# EAGLE design 04A-020 (EAGLE 6.3)
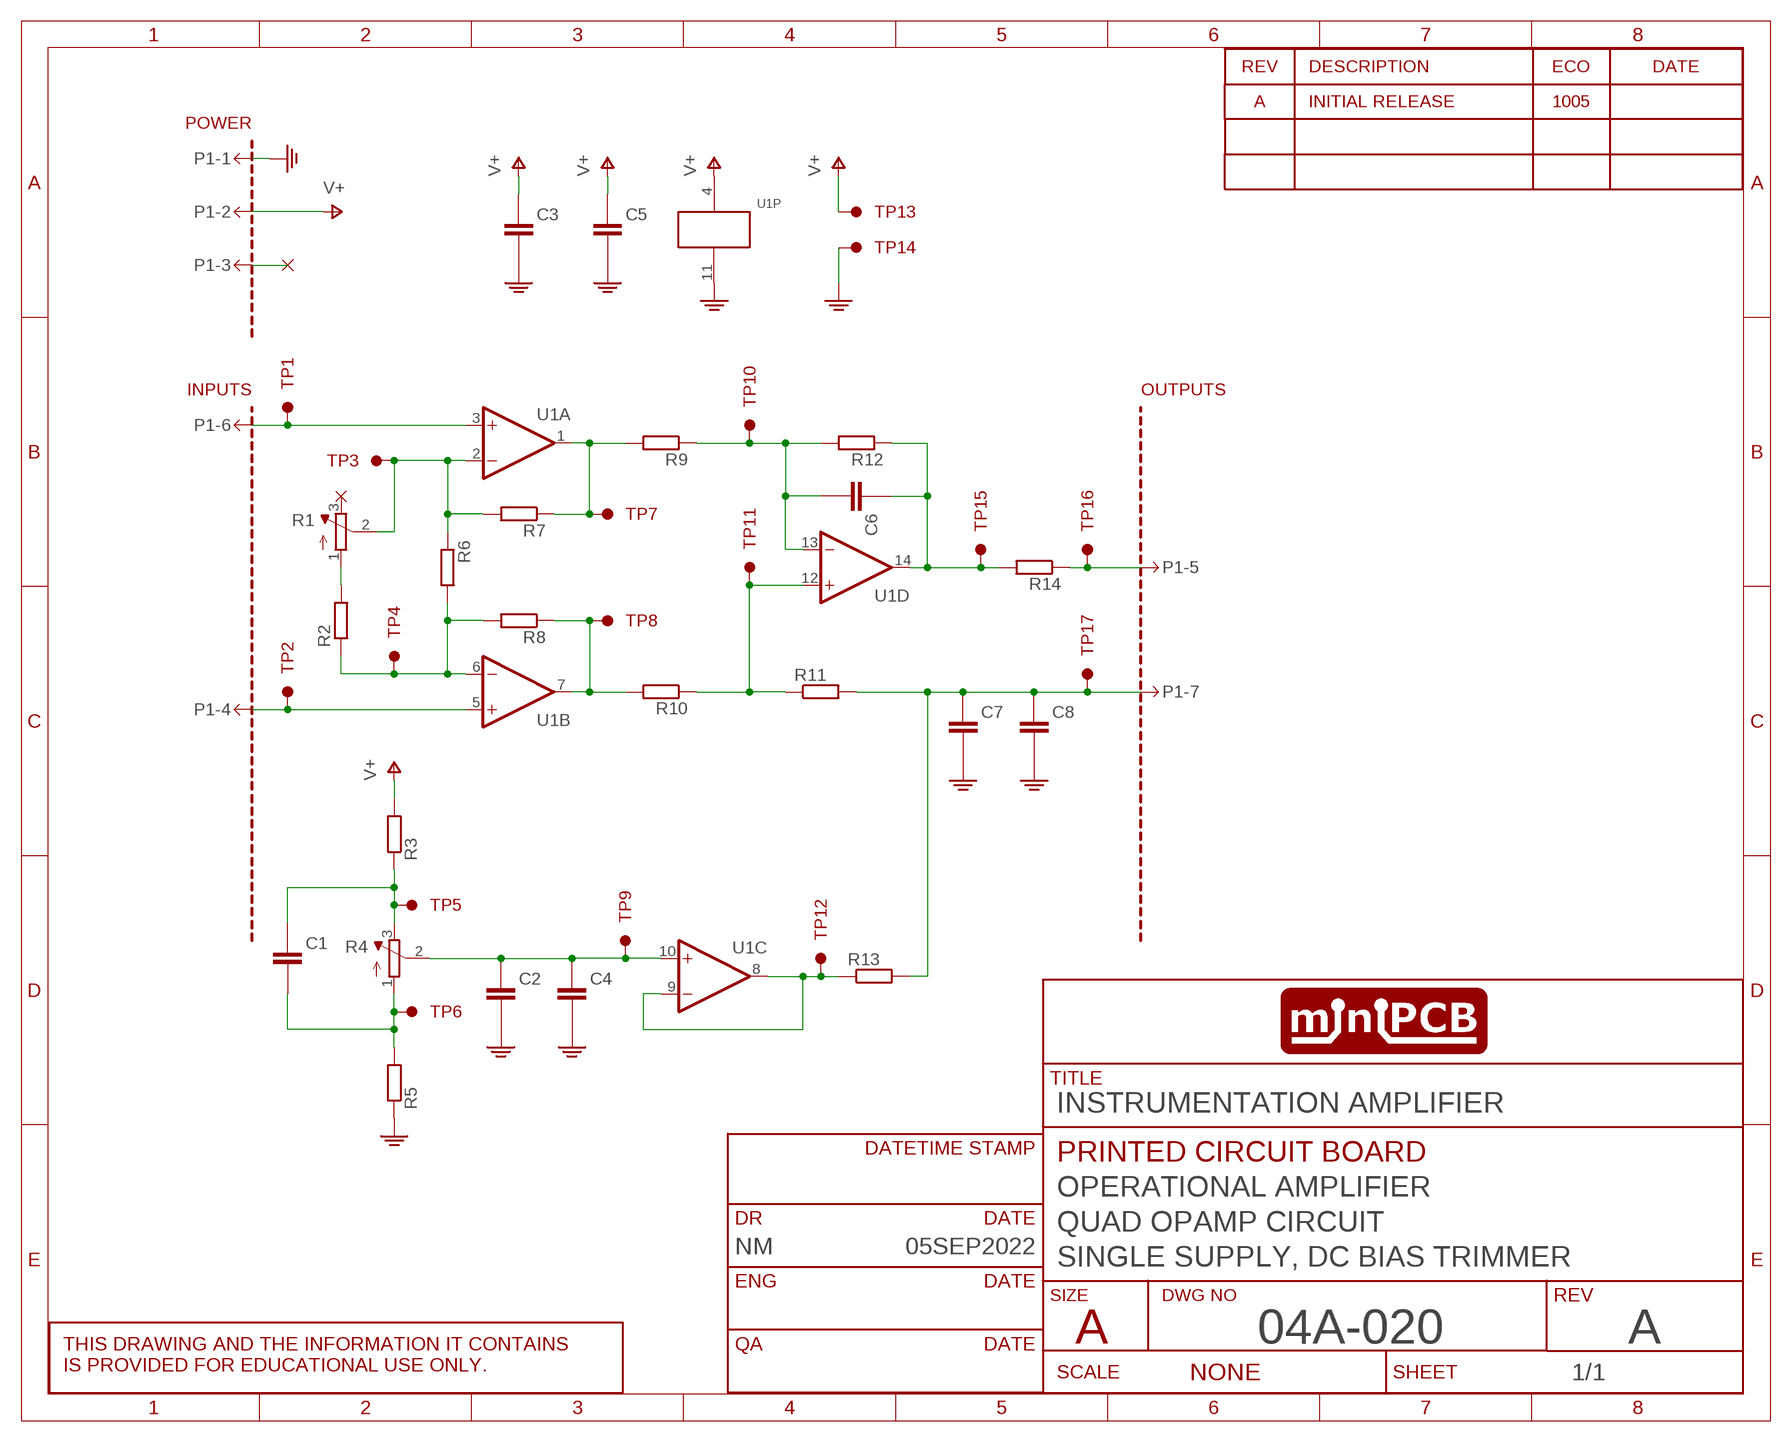
[diagram p0: schematic, sheet 1]
SHEET1 (SCHEMATIC): CIRCUIT_CATEGORY: OPERATIONAL AMPLIFIER; CIRCUIT_NAME: QUAD OPAMP CIRCUIT; CIRCUIT_VARIANT: SINGLE SUPPLY, DC BIAS TRIMMER; DR: NM; DR_DATE: 05SEP2022; REVA: A; REVA_ECO: 1005; REVISION: A; TITLE: INSTRUMENTATION AMPLIFIER

## Parts
C1  CAPACITORTHD  [C050-024X044]
C2  CAPACITORTHD  [C050-024X044]
C3  CAPACITORTHD  [C050-024X044]
C4  CAPACITORTHD  [C050-024X044]
C5  CAPACITORTHD  [C050-024X044]
C6  CAPACITORTHD  [C050-024X044]
C7  CAPACITORTHD  [C050-024X044]
C8  CAPACITORTHD  [C050-024X044]
P1-  MINIPCB_7P50X100  [MINIPCB_7P_50X100]
R1  TRIMPOT0.100THD  [TRIM_0100]
R2  RESISTOR10MM  [0207/10]
R3  RESISTOR10MM  [0207/10]
R4  TRIMPOT0.100THD  [TRIM_0100]
R5  RESISTOR10MM  [0207/10]
R6  RESISTOR10MM  [0207/10]
R7  RESISTOR10MM  [0207/10]
R8  RESISTOR10MM  [0207/10]
R9  RESISTOR10MM  [0207/10]
R10  RESISTOR10MM  [0207/10]
R11  RESISTOR10MM  [0207/10]
R12  RESISTOR10MM  [0207/10]
R13  RESISTOR10MM  [0207/10]
R14  RESISTOR10MM  [0207/10]
TP1  TESTPOINTKE5000-SMTEXT  [PINS_1_TESTPOINT_KE5000_NOTEXT]
TP2  TESTPOINTKE5000-SMTEXT  [PINS_1_TESTPOINT_KE5000_NOTEXT]
TP3  TESTPOINTKE5000-SMTEXT  [PINS_1_TESTPOINT_KE5000_NOTEXT]
TP4  TESTPOINTKE5000-SMTEXT  [PINS_1_TESTPOINT_KE5000_NOTEXT]
TP5  TESTPOINTKE5000-SMTEXT  [PINS_1_TESTPOINT_KE5000_NOTEXT]
TP6  TESTPOINTKE5000-SMTEXT  [PINS_1_TESTPOINT_KE5000_NOTEXT]
TP7  TESTPOINTKE5000-SMTEXT  [PINS_1_TESTPOINT_KE5000_NOTEXT]
TP8  TESTPOINTKE5000-SMTEXT  [PINS_1_TESTPOINT_KE5000_NOTEXT]
TP9  TESTPOINTKE5000-SMTEXT  [PINS_1_TESTPOINT_KE5000_NOTEXT]
TP10  TESTPOINTKE5000-SMTEXT  [PINS_1_TESTPOINT_KE5000_NOTEXT]
TP11  TESTPOINTKE5000-SMTEXT  [PINS_1_TESTPOINT_KE5000_NOTEXT]
TP12  TESTPOINTKE5000-SMTEXT  [PINS_1_TESTPOINT_KE5000_NOTEXT]
TP13  TESTPOINTKE5000-SMTEXT  [PINS_1_TESTPOINT_KE5000_NOTEXT]
TP14  TESTPOINTKE5000-SMTEXT  [PINS_1_TESTPOINT_KE5000_NOTEXT]
TP15  TESTPOINTKE5000-SMTEXT  [PINS_1_TESTPOINT_KE5000_NOTEXT]
TP16  TESTPOINTKE5000-SMTEXT  [PINS_1_TESTPOINT_KE5000_NOTEXT]
TP17  TESTPOINTKE5000-SMTEXT  [PINS_1_TESTPOINT_KE5000_NOTEXT]
U1  OPAMP_QUADTHD  [DIL14]

## Nets
BIAS: C2.1(+) C4.1(+) R4.2(S) TP9.1 U1.10(C:+IN)
GND: C2.2(-) C3.2(-) C4.2(-) C5.2(-) C7.2(-) C8.2(-) P1-.1 R5.1 TP14.1 U1.11(P:V-)
N$1: R10.1 R11.1 TP11.1 U1.12(D:+IN)
N$2: C7.1(+) C8.1(+) P1-.7 R11.2 R13.2 TP17.1
N$3: P1-.4 TP2.1 U1.5(B:+IN)
N$4: P1-.6 TP1.1 U1.3(A:+IN)
N$5: R1.2(S) R6.1 R7.2 TP3.1 U1.2(A:-IN)
N$6: R2.1 R6.2 R8.2 TP4.1 U1.6(B:-IN)
N$7: R7.1 R9.2 TP7.1 U1.1(A:OUT)
N$8: R8.1 R10.2 TP8.1 U1.7(B:OUT)
N$9: R13.1 TP12.1 U1.8(C:OUT) U1.9(C:-IN)
N$10: R1.1(A) R2.2
N$11: P1-.5 R14.1 TP16.1
NC: P1-.3
OUT: C6.1(+) R12.1 R14.2 TP15.1 U1.14(D:OUT)
POT.1: C1.2(-) R4.1(A) R5.2 TP6.1
POT.3: C1.1(+) R3.1 R4.3(E) TP5.1
V+: C3.1(+) C5.1(+) P1-.2 R3.2 TP13.1 U1.4(P:V+)
VFB: C6.2(-) R9.1 R12.2 TP10.1 U1.13(D:-IN)
Unconnected: R1.3(E)

## Library data of the parts
C1-C8 = minipcb:CAPACITOR
P1- = minipcb:MINIPCB_7P; PART_NUMBER: X04A-020-A
R1 R4 = minipcb:TRIMPOT: SMT trimmer potentiometer part number TC33X http://www.ladyada.net/library/eagle
R2 R3 R5-R14 = minipcb:RESISTOR
TP1-TP17 = minipcb:TESTPOINT
U1 = minipcb:OPAMP_QUAD: OP AMP

## Board
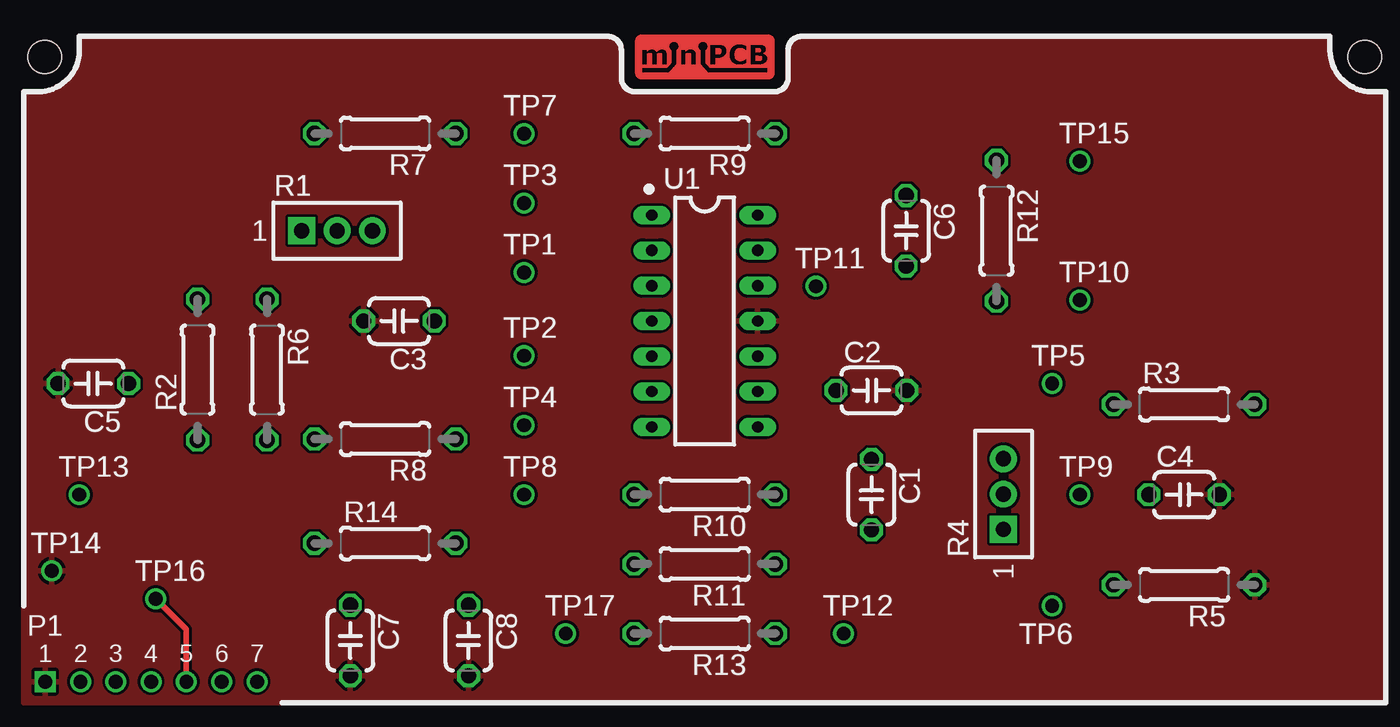
[diagram p1: board, top side]
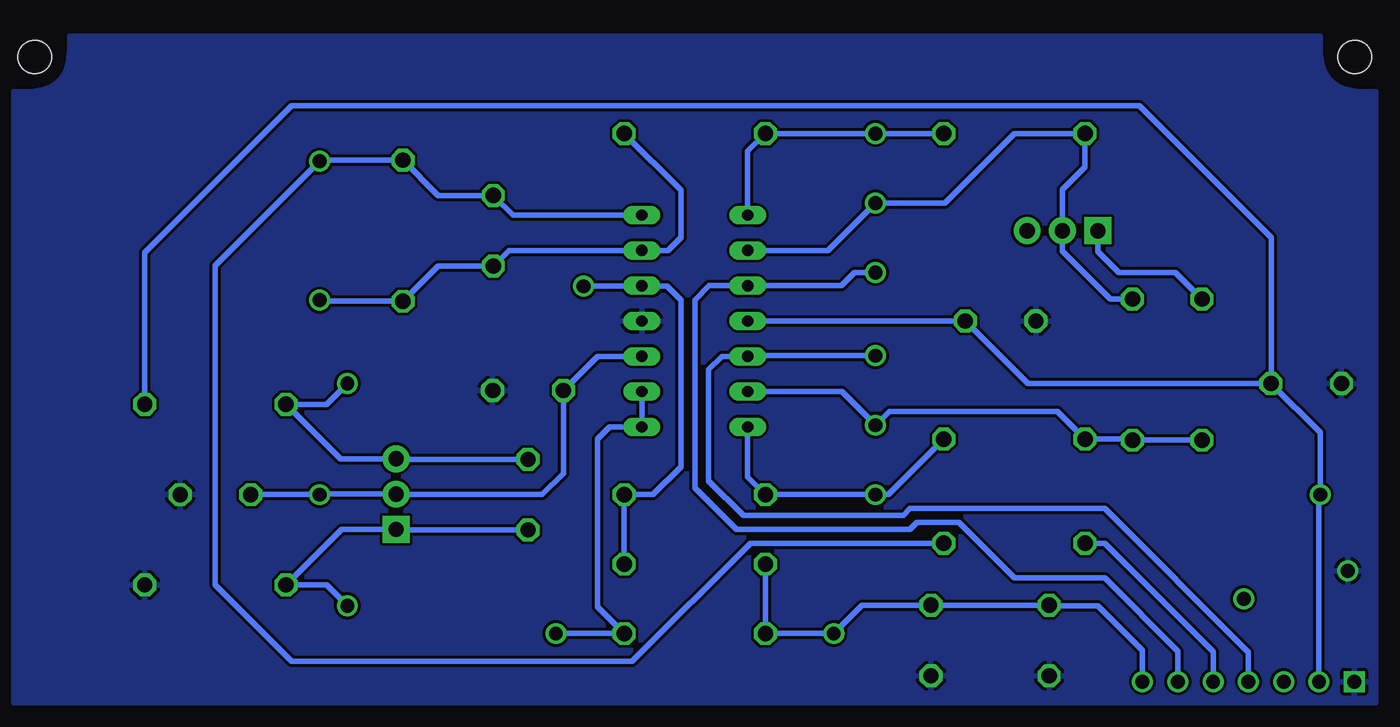
[diagram p2: board, bottom side, seen from below]

No outline drawn. Coordinates in mm, seen from the top.
Copper layers (1*16): Top 0.035mm / dielectric 1.5mm / Bottom 0.035mm
Design rules "minipcb": minimum track width 10mil, minimum drill 24mil, track to track 8mil, track to pad 8mil, pad to pad 8mil, via to via 8mil, smd to smd 8mil, copper to edge 40mil, drill to drill 8mil, minimum pad ring 10mil, minimum via ring 8mil, stop-mask expansion 4mil, vias tented up to drill 20mil, thermal gap 10mil

### Footprints (pad centres in the part's own frame; a part is rotated, then mirrored left to right if it is on the bottom)
C050-024X044 = drill 1.1 octagon: 1 -2.54,0; 2 2.54,0
MINIPCB_7P_50X100 = drill 1 square: 1 2.54,2.54 | drill 1: 2 5.08,2.54; 3 7.62,2.54; 4 10.16,2.54; 5 12.7,2.54; 6 15.24,2.54; 7 17.78,2.54 | hole 2.4: 97.5,47.5; 2.5,47.5
TRIM_0100 = drill 1.1 pad 1.93 square: 1 0,0 | drill 1.1 pad 1.93: 2 2.54,0; 3 5.08,0
0207/10 = drill 1.1 octagon: 1 -5.08,0; 2 5.08,0
PINS_1_TESTPOINT_KE5000_NOTEXT = drill 1: 1 0,0
DIL14 = drill 0.813 long: 1 -7.62,-3.81; 2 -5.08,-3.81; 3 -2.54,-3.81; 4 0,-3.81; 5 2.54,-3.81; 6 5.08,-3.81; 7 7.62,-3.81; 8 7.62,3.81; 9 5.08,3.81; 10 2.54,3.81; 11 0,3.81; 12 -2.54,3.81; 13 -5.08,3.81; 14 -7.62,3.81

### Placement (x,y rotation side)
C1  62,16 270 top
C2  62,23.5 0 top
C3  28,28.5 180 top
C4  84.5,16 0 top
C5  6,24 180 top
C6  64.5,35 270 top
C7  24.5,5.5 270 top
C8  33,5.5 270 top
P1-  0,0 0 top
R1  21,35 0 top
R2  13.5,25 90 top
R3  84.5,22.5 0 top
R4  71.5,13.5 90 top
R5  84.5,9.5 180 top
R6  18.5,25 270 top
R7  27,42 180 top
R8  27,20 180 top
R9  50,42 180 top
R10  50,16 180 top
R11  50,11 180 top
R12  71,35 270 top
R13  50,6 180 top
R14  27,12.5 0 top
TP1  37,32 0 top
TP2  37,26 0 top
TP3  37,37 0 top
TP4  37,21 0 top
TP5  75,24 0 top
TP6  75,8 180 top
TP7  37,42 0 top
TP8  37,16 0 top
TP9  77,16 0 top
TP10  77,30 0 top
TP11  58,31 0 top
TP12  60,6 0 top
TP13  5,16 0 top
TP14  3,10.5 0 top
TP15  77,40 0 top
TP16  10.5,8.5 0 top
TP17  40,6 0 top
U1  50,28.5 270 top

### Tracks (layer width: path | path; a pad name or v marks a point on that pad's centre or on a via)
BIAS
  Bottom 0.406: U1.10 57,25.96 C2.1 59.46,17.54 61,16 71.46,16 R4.2 76.96,16.04 TP9.1 C4.1
GND
  pour Bottom: 1,1 99,1 99,45 98,45 arc-90 95,48 95,49 5,49 5,48 arc-90 2,45 1,45
  pour Top: 1,1 99,1 99,45 98,45 arc-90 95,48 95,49 57,49 arc90 56,48 56,46 arc-90 55,45 45,45 arc-90 44,46 44,48 arc90 43,49 5,49 5,48 arc-90 2,45 1,45
N$1
  Bottom 0.406: R11.1 R10.1 53,16 51,18 51,30 52,31 53.77,31 U1.12 53.85,31 TP11.1
N$2
  Bottom 0.406: R11.2 R13.2 TP17.1 37.96,8.04 C8.1 C7.1 24.46,8 21,8 17.78,4.78 P1-.7
N$3
  Bottom 0.406: TP2.1 46.15,26 U1.5 48.04,25.96 49,25 49,17 46.5,14.5 35,14.5 34.5,15 20.5,15 10.16,4.66 P1-.4
N$4
  Bottom 0.406: TP1.1 38.5,32 39.46,31.04 U1.3 48.96,31.04 50,30 50,16.5 47,13.5 34.5,13.5 34,14 31,14 27,10 20.5,10 15.24,4.74 P1-.6
N$5
  Bottom 0.406: U1.2 40.42,33.58 TP3.1 32,37 27,42 R7.2 21.92,39.58 23.54,37.96 R1.2 23.54,33.54 20.08,30.08 R6.1
N$6
  Bottom 0.406: U1.6 39.42,23.42 TP4.1 36,22 23.92,22 R8.2 18.58,20 R6.2 R2.1
N$7
  Bottom 0.406: R7.1 TP7.1 R9.2 46.19,40.73 U1.1
N$8
  Bottom 0.406: U1.7 46.19,17.27 R10.2 TP8.1 36.08,16 R8.1
N$9
  Bottom 0.406: U1.9 U1.8 56.12,20.88 57,20 57,7.92 R13.1 TP12.1
N$10
  Bottom 0.406: R2.2 15.42,32 19.5,32 21,33.5 R1.1
N$11
  Top 0.406: P1-.5 12.7,6.3 TP16.1
  Bottom 0.406: P1-.5 12.7,4.7 20.5,12.5 R14.1
OUT
  Bottom 0.406: U1.14 63.08,36.12 C6.1 68.46,37.54 R12.1 76.92,40.08 TP15.1 84.5,32.5 84.5,9.5 79,4 54.5,4 46,12.5 R14.2
POT.1
  Bottom 0.406: C1.2 71.46,13.46 R4.1 75.42,13.5 R5.2 76.5,9.5 TP6.1
POT.3
  Bottom 0.406: C1.1 71.46,18.54 R4.3 75.5,18.58 R3.1 76.5,22.5 TP5.1
V+
  Bottom 0.406: P1-.2 5.08,16 TP13.1 5,20.46 C5.1 | U1.4 C3.1 26.04,24 C5.1 | R3.2 89.58,33.42 79,44 18,44 8.5,34.5 8.5,24.04 C5.1
VFB
  Bottom 0.406: R9.1 51,37.92 51,34.5 51.92,33.58 U1.13 63.38,33.58 C6.2 68.46,32.46 R12.2 76.92,29.92 TP10.1

### Text on the board
_tNames: TP7 | TP15 | R7 | R9 | R1 | TP3 | U1 | R12 | C6 | TP1 | TP11 | TP10 | R6 | TP2 | C3 | C2 | TP5 | R3 | C5 | R2 | TP4 | R8 | C1 | C4 | TP13 | TP8 | TP9 | R14 | R10 | TP14 | R4 | TP16 | R11 | C7 | C8 | R5 | TP17 | TP12 | TP6 | R13